# EasyEDA Pro project 2.4G8通道接收板1代.epro

# Schematic 2.4G8通道接收板
Create Date: 2023-10-29; Page Name: P1; Project Name: 遥控小车驱动小板; Schematic Name: 2.4G8通道遥控板; Update Date: 2023-11-30; Company: 嘉立创EDA; Page Size: A4; Version: V1.0
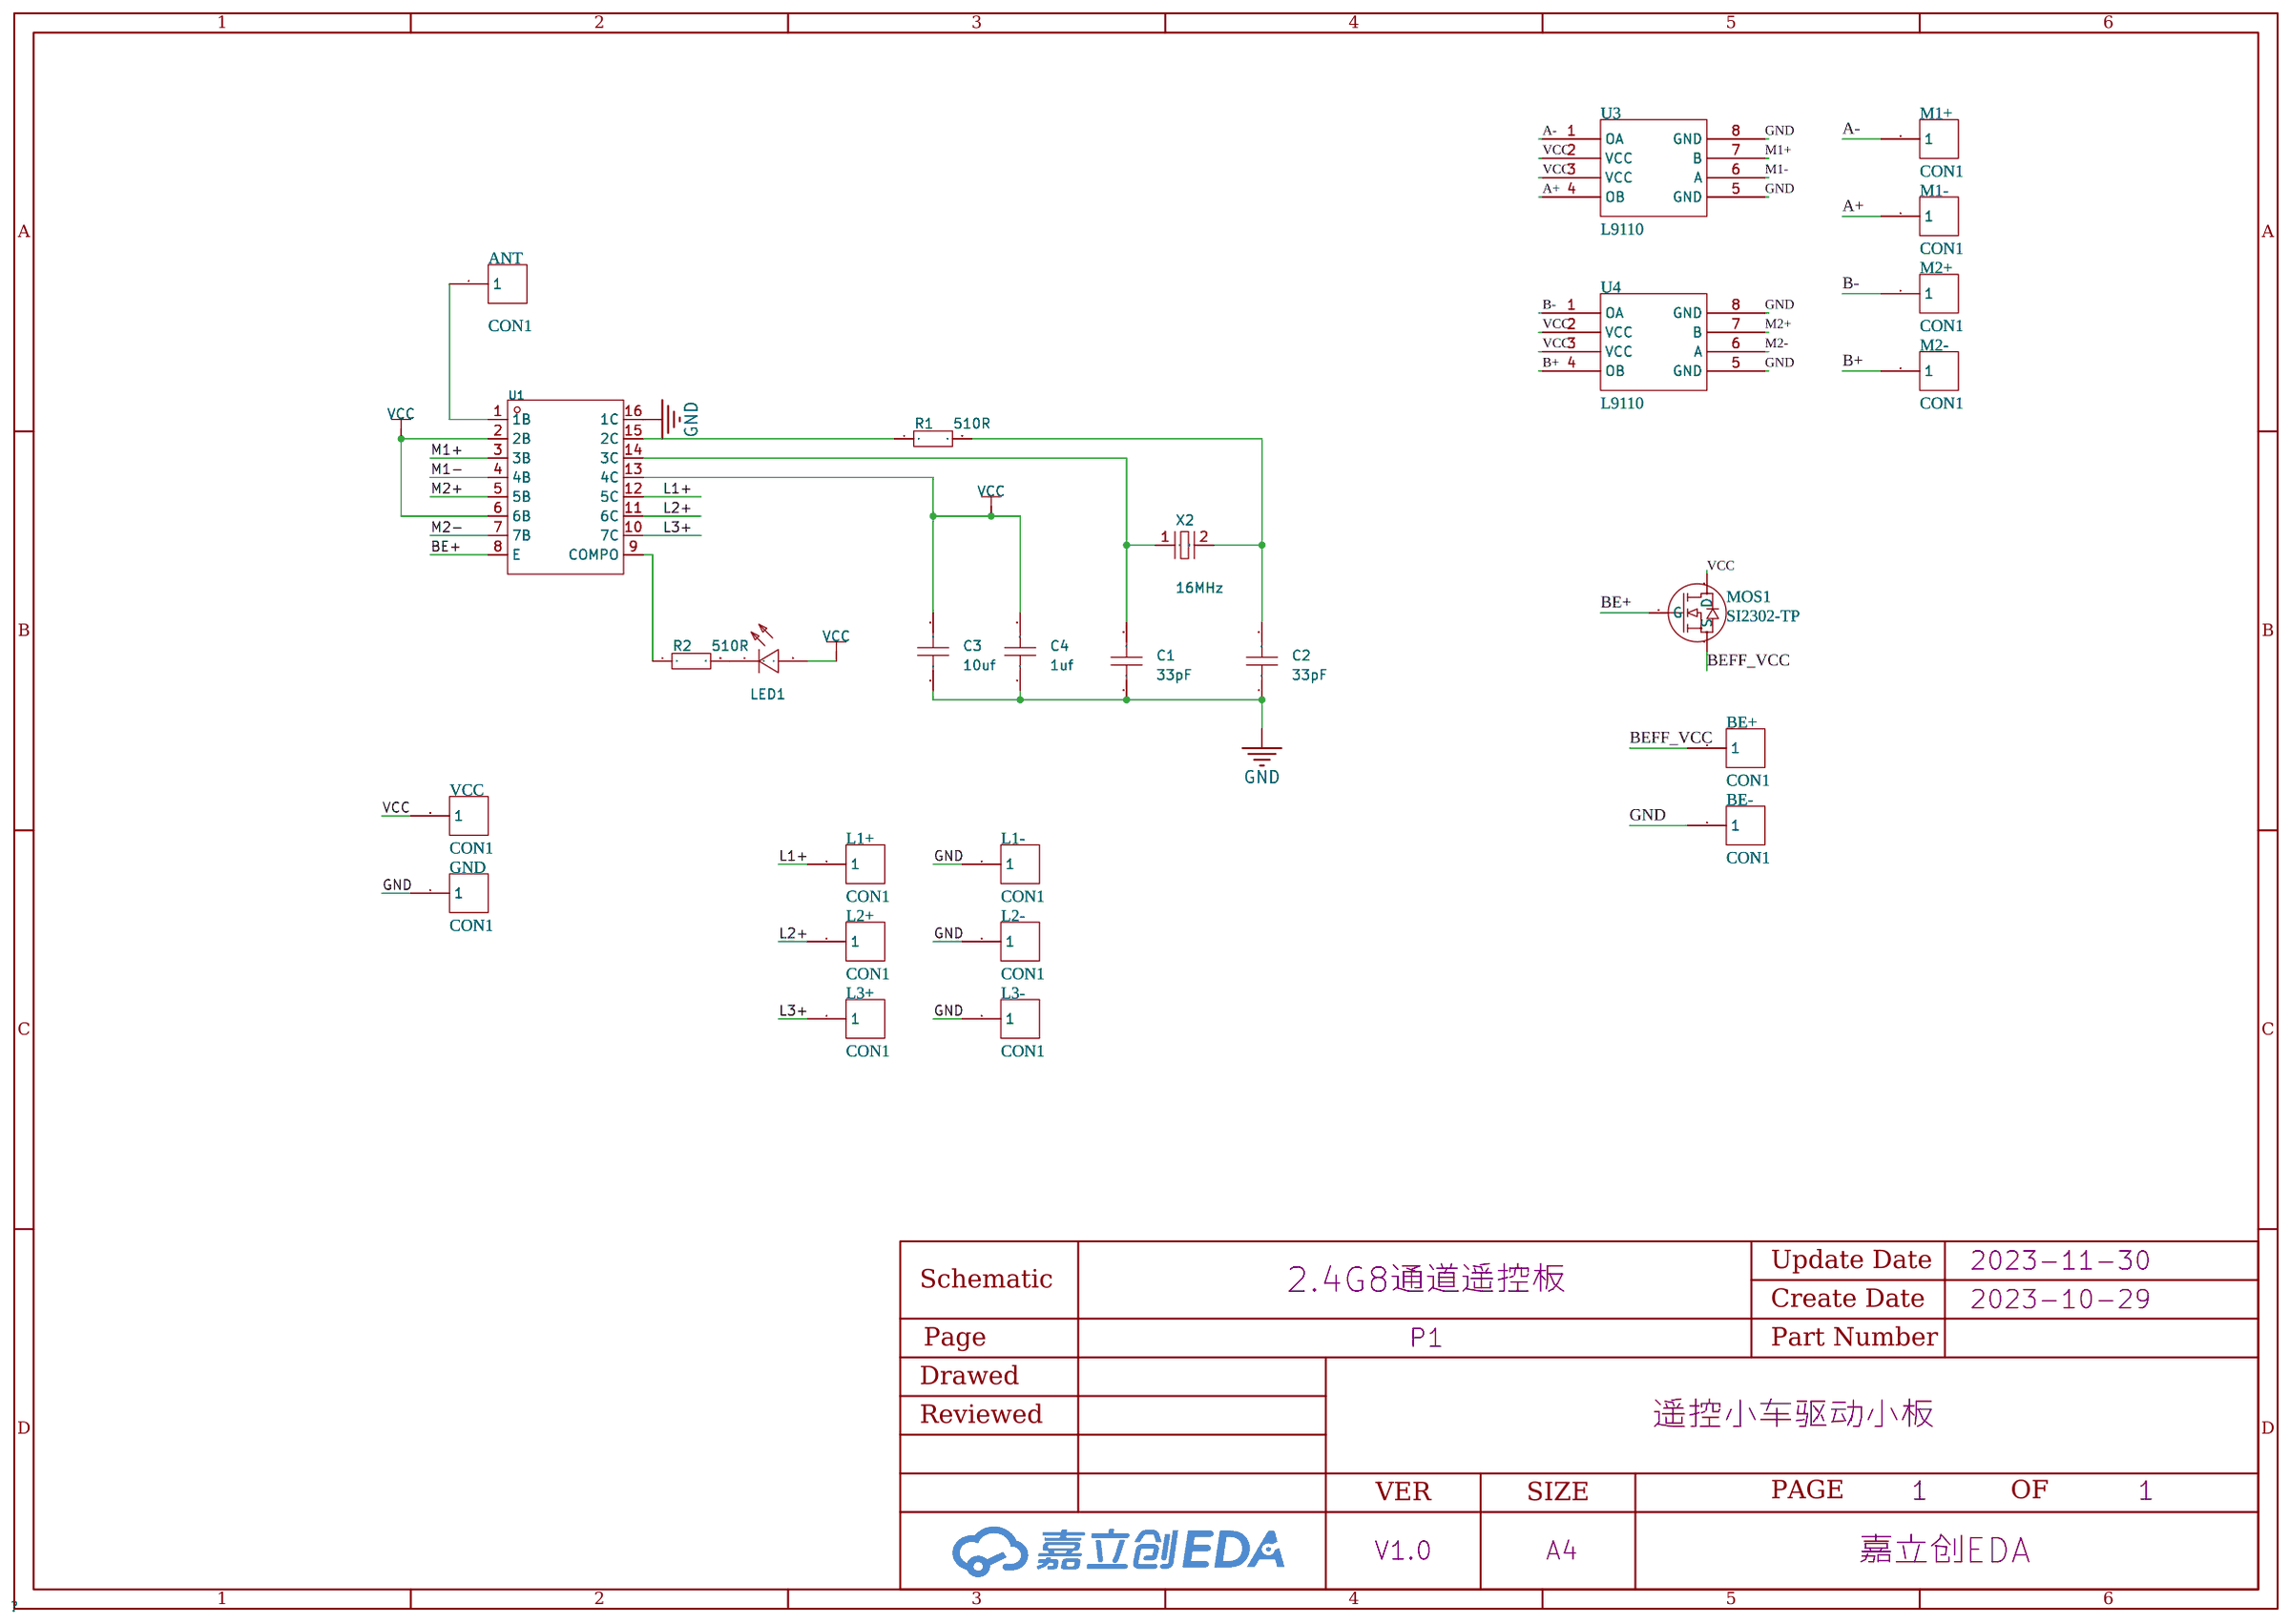
[diagram p0: schematic sheet]

## Parts
ANT  CON1  [CON1_2]
BE+  CON1  [CON1_2]
BE-  CON1  [CON1_2]
C1  33pF  [C0603]
C2  33pF  [C0603]
C3  10uf  [C0603]
C4  1uf  [C0603]
GND  CON1  [CON1_2]
L1+  CON1  [CON1_2]
L1-  CON1  [CON1_2]
L2+  CON1  [CON1_2]
L2-  CON1  [CON1_2]
L3+  CON1  [CON1_2]
L3-  CON1  [CON1_2]
LED1  NCD0603R1  [LED0603-RD_RED]
M1+  CON1  [CON1_2]
M1-  CON1  [CON1_2]
M2+  CON1  [CON1_2]
M2-  CON1  [CON1_2]
MOS1  SI2302-TP  [SOT-23_MCC]
R1  510R  [R0603]
R2  510R  [R0603]
U1  ULN2003A  [SOP-16_L10.0-W3.9-P1.27-LS6.0-BL]
U3  L9110  [SOP8]
U4  L9110  [SOP8]
VCC  CON1  [CON1_2]
X2  16MHz  [CRYSTAL-TH_BD3.0-P1.10-D0.4]

## Library data of the parts
ANT BE+ BE- GND L1+ L1- L2+ L2- L3+ L3- M1+ M1- M2+ M2- VCC = CON1: Library Name: 杰梗原理图库
C1-C4 = CAP_0603: Supplier Footprint: 0603
LED1 = NCD0603R1_C84263: 发光颜色:红色;功率:65mW;透镜颜色:无色透明;主波长:615nm~630nm;发光强度:80mcd~220mcd;发光角度:130°;工作温度:-30℃~+85℃;; LCSC Part Name: 红灯 0603红灯   正贴; Supplier Part: C84263; Manufacturer: 国星光电; Supplier Footprint: 0603; JLCPCB Part Class: 扩展库; Datasheet: https://atta.szlcsc.com/upload/public/pdf/source/20200820/C84263_DABC6A75E58F576973B407FDBA283D60.pdf; Supplier: LCSC; Emitted Color: 红色; Forward Voltage (VF): 1.6V~2.6V; Forward Current: 20mA; Power Dissipation: 65mW; Lens Color: 无色透明; Dominant Wavelength: 615nm~630nm; Luminous Intensity: 80mcd~220mcd; Viewing Angle: 130°; Operating Temperature: -30℃~+85℃
MOS1 = SI2302-TP: No Description Available; Copyright: Copyright (C) 2022 Ultra Librarian. All rights reserved.; Mfr_Name: MCC; Type: DEV
R1 R2 = Res_0603: Supplier Footprint: 0603
U1 = ULN2003A_C482013: 开态输入电压(VI(on)@Vce,Ic):3V@2V,300mA;集射极饱和压降(VCE(sat)@Ii,Ic):900mV;开态输入电流(Ii@Vi):930uA@3.85V;; Supplier Part: C482013; Manufacturer: UMW(友台半导体); Supplier Footprint: SOP-16; JLCPCB Part Class: 扩展库; Datasheet: https://atta.szlcsc.com/upload/public/pdf/source/20210729/C482013_EA98BD063A0F1E79EB7301A16A5D0011.pdf; Supplier: LCSC; ON-state input   voltage(VI(on)@Vce,Ic): 3V@2V,300mA; Collector-emitter   saturation voltage (VCE(sat)@Ii,Ic): 900mV; Output leakage current (Icex@Vce): 20uA@50V; Input current (Ii@Vi): 930uA@3.85V; Off-state input current (Ii(off)@Vce,Ic): 100uA@500uA; Clamp Diode Leakage Current (IR@VR): 5uA@50V; Clamp Diode Forward Voltage (VF@IF): 1.7V@350mA; Input Capacitance (Ci): 15pF; Operating Temperature: -40℃~+85℃
U3 U4 = L9110: Library Name: 杰梗原理图库
X2 = Q3816000ZWFAC: 频率:16MHz;频率公差:±20ppm;负载电容:20pF;; LCSC Part Name: 16MHz ±20ppm 20pF; Supplier Part: C2686281; Manufacturer: JYJE(晶友嘉); Supplier Footprint: DT-38; JLCPCB Part Class: Extended Part; Datasheet: https://atta.szlcsc.com/upload/public/pdf/source/20210125/C2686274_6F24C78119C1F58B7C4228EDB3C8DB66.pdf; Supplier: LCSC; Crystal Type: 直插无源晶振; Frequency Tolerance: ±20ppm; Frequency Stability: ±30ppm; Load Capacitance: 20pF; Equivalent Series Resistance (ESR): 60Ω; Operating Temperature: -40℃~+85℃

## Nets
GND: BE-.1 C1.1 C2.1 C3.1 C4.1 GND.1 L1-.1 L2-.1 L3-.1 U1.16(1C) U3.5(GND) U3.8(GND) U4.5(GND) U4.8(GND)
VCC: C3.2 C4.2 LED1.2(A) MOS1.3(D) U1.2(2B) U1.6(6B) U1.13(4C) U3.2(VCC) U3.3(VCC) U4.2(VCC) U4.3(VCC) VCC.1
A+: M1-.1 U3.4(OB)
A-: M1+.1 U3.1(OA)
B+: M2-.1 U4.4(OB)
B-: M2+.1 U4.1(OA)
BE+: MOS1.1(G) U1.8(E)
BEFF_VCC: BE+.1 MOS1.2(S)
L1+: L1+.1 U1.12(5C)
L2+: L2+.1 U1.11(6C)
L3+: L3+.1 U1.10(7C)
M1+: U1.3(3B) U3.7(B)
M1-: U1.4(4B) U3.6(A)
M2+: U1.5(5B) U4.7(B)
M2-: U1.7(7B) U4.6(A)
$1N1074: LED1.1(K) R2.2
Net-(ANT-1): ANT.1 U1.1(1B)
Net-(C1-2): C1.2 U1.14(3C) X2.1
Net-(C2-2): C2.2 R1.2 X2.2(GND)
Net-(R1-1): R1.1 U1.15(2C)
Net-(R2-1): R2.1 U1.9(COMPO)

# Board 2.4G8通道接收板
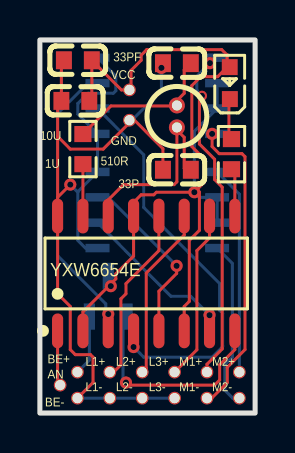
[diagram p1: board, top side]
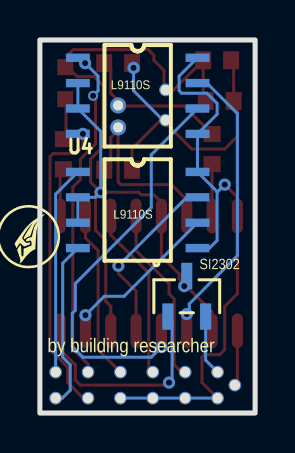
[diagram p2: board, bottom side, seen from below]

Outline 10.79 x 18.67 mm; copper layers: Top Layer, Bottom Layer. Coordinates in mm from the lower left corner of the outline.
Outline path: rectangle 0,18.67 10.79,0
Stack: Top Layer 0.035mm / Dielectric1 1.51mm FR4 er 4.5 / Bottom Layer 0.035mm

## Design rules (mm)
template: JLCPCB Capability(Two Layers Board)
spacing copperThickness1oz (default): track to track 0.102, other pairs 0.152 to 0.3
spacing copperThickness2oz: track to track 0.203, other pairs 0.152 to 0.3
track width copperThickness1oz (default): min 0.127, default 0.254, max 2.54
track width copperThickness2oz: min 0.203, default 0.254, max 2.54
differential pair differentialPair (default): width min 0.127, default 0.254, max 2.54; gap min 0.152, default 0.152
via viaSize (default): diameter min 0.5, default 0.61, max 10; hole min 0.3, default 0.305, max 6.3

## Placement (name value [footprint] x y rotation side)
1U  1uf  [C0603]  1.78 15.62 0 top
10U  10uf  [C0603]  1.91 17.65 0 top
33P  33pF  [C0603]  6.87 12.17 0 top
33PF  33pF  [C0603]  6.87 17.51 0 top
510R  510R  [R0603]  2.16 13.21 90 top
AN  CON1  [CON1_2]  1.02 1.4 0 top
BE+  CON1  [CON1_2]  1.88 2.05 0 top
BE-  CON1  [CON1_2]  1.88 0.75 0 top
GND  CON1  [CON1_2]  4.49 14.65 0 top
L1+  CON1  [CON1_2]  3.51 2.05 90 top
L1-  CON1  [CON1_2]  3.51 0.75 0 top
L2+  CON1  [CON1_2]  5.13 2.05 90 top
L2-  CON1  [CON1_2]  5.13 0.75 0 top
L3+  CON1  [CON1_2]  6.76 2.05 90 top
L3-  CON1  [CON1_2]  6.76 0.75 0 top
L9110S  -  [SOP8]  8.89 17.78 180 bottom
L9110S#2  -  [SOT-23_MCC]  3.43 5.84 180 bottom
LED1  NCD0603R1  [LED0603-RD_RED]  9.52 16.51 90 top
M1+  CON1  [CON1_2]  8.38 2.05 0 top
M1-  CON1  [CON1_2]  8.38 0.75 0 top
M2+  CON1  [CON1_2]  10 2.05 0 top
M2-  CON1  [CON1_2]  10 0.75 0 top
R2  510R  [R0603]  9.61 12.95 90 top
U4  L9110  [SOP8]  8.89 12.06 180 bottom
VCC  CON1  [CON1_2]  4.49 16.17 0 top
X2  16MHz  [CRYSTAL-TH_BD3.0-P1.10-D0.4]  6.87 14.84 90 top
YXW6654E  ULN2003A  [SOP-16_L10.0-W3.9-P1.27-LS6.0-BL]  5.33 6.98 0 top

## Footprints (pads in the part's own frame, mm; a bottom-side part is the same pattern mirrored in y, then rotated)
C0603
  rect 0.8x0.9 smd: 1(-0.7,0) 2(0.7,0)
CON1_2
  round 0.635 hole 0.508: 1(0,0)
CRYSTAL-TH_BD3.0-P1.10-D0.4
  round 0.8 hole 0.5: 1(-0.55,0) 2(0.55,0)
LED0603-RD_RED
  rect 0.8x0.8 smd: 1(-0.799,-0.004) 2(0.799,0.004)
R0603
  rect 0.806x0.864 smd: 1(-0.753,0) 2(0.753,0)
SOP8
  rect 1.2x0.42 smd: 1(0,0) 2(0,-1.27) 3(0,-2.54) 4(0,-3.81) 5(6,-3.81) 6(6,-2.54) 7(6,-1.27) 8(6,0)
SOP-16_L10.0-W3.9-P1.27-LS6.0-BL
  oval 0.56x1.745 smd: 1(-4.445,-2.873) 2(-3.175,-2.873) 3(-1.905,-2.873) 4(-0.635,-2.873) 5(0.635,-2.873) 6(1.905,-2.873) 7(3.175,-2.873) 8(4.445,-2.873) 9(4.445,2.873) 10(3.175,2.873) 11(1.905,2.873) 12(0.635,2.873) 13(-0.635,2.873) 14(-1.905,2.873) 15(-3.175,2.873) 16(-4.445,2.873)
SOT-23_MCC
  rect 0.559x1.321 smd: 1(-0.946,-1.016) 2(0.946,-1.016) 3(0,1.016)

## Nets
GND: 1U.1 10U.1 33P.1 33PF.1 BE-.1 GND.1 L1-.1 L2-.1 L3-.1 L9110S.5 L9110S.8 U4.5 U4.8 YXW6654E.16
VCC: 1U.2 10U.2 L9110S.2 L9110S.3 L9110S#2.3 LED1.2 U4.2 U4.3 VCC.1 YXW6654E.2 YXW6654E.6 YXW6654E.13
A+: L9110S.4 M1-.1
A-: L9110S.1 M1+.1
B+: M2-.1 U4.4
B-: M2+.1 U4.1
BE+: L9110S#2.1 YXW6654E.8
BEFF_VCC: BE+.1 L9110S#2.2
L1+: L1+.1 YXW6654E.12
L2+: L2+.1 YXW6654E.11
L3+: L3+.1 YXW6654E.10
M1+: L9110S.7 YXW6654E.3
M1-: L9110S.6 YXW6654E.4
M2+: U4.7 YXW6654E.5
M2-: U4.6 YXW6654E.7
$1N661: 33PF.2 510R.2 X2.2
$1N667: 510R.1 YXW6654E.15
$1N672: 33P.2 X2.1 YXW6654E.14
$1N923: AN.1 YXW6654E.1
$1N1074: LED1.1 R2.2
$1N1154: R2.1 YXW6654E.9

## Via types
v1: diameter 0.61, hole 0.305, Top Layer to Bottom Layer, 11 vias
v2: diameter 0.508, hole 0.305, Top Layer to Bottom Layer, 1 via

## Routing (per net, layer and track width the routed paths; a pad name or vN(x,y) marks a point on that pad's centre or on a via; arc(x,y) is an arc through that point)
GND: length 49.1
  Top Layer w0.152: 0.89,10.8 0.89,13.84 ; 0.89,10.8 v1(1.52,11.43) ; 0.89,10.8 YXW6654E.16 0.89,5.97 1.52,5.33 1.52,3.17 1.78,2.92 2.54,2.92 2.67,2.79 2.67,1.53 BE-.1 ; 0.89,13.84 0.89,15.43 1U.1 1.08,17.53 10U.1 ; 0.89,13.84 0.89,13.84 1.52,13.21 3.17,13.21 4.68,14.72 6.17,13.23 6.17,12.05
  Bottom Layer w0.152: v1(6.1,17.27) 6.1,16.13 4.68,14.72 4.75,14.65 ; 1.91,11.05 1.91,11.08 U4.8 L9110S.5 1.91,14.95 1.91,15.49 2.41,16 3.68,16 3.81,16.13 3.81,16.86 L9110S.8 ; 1.91,11.05 v1(1.52,11.43) ; 1.91,11.05 1.91,8.64 2.29,8.25 U4.5 ; BE-.1 L1-.1 L2-.1 L3-.1
VCC: length 46.5
  Top Layer w0.152: v1(7.75,11.05) 8.25,11.56 8.25,12.7 7.62,13.33 7.62,16.38 8.07,16.83 8.92,16.83 9.39,17.31 ; v1(7.75,11.05) 8,11.05 8,9.14 7.49,8.64 7.49,5.59 7.24,5.33 YXW6654E.6 ; v1(7.75,11.05) 5.84,11.05 5.72,10.92 5.08,10.92 4.7,10.54 4.7,7.85 3.81,6.96 3.81,6.71 2.16,5.06 YXW6654E.2 ; 1U.2 2.6,15.75 10U.2 4.09,16.17 4.57,16.17 4.57,17.14 5.08,17.65 5.08,17.91 5.36,18.19 9.12,18.19 9.39,17.91 9.39,17.31 ; 9.39,17.31 LED1.2
  Bottom Layer w0.152: U4.3 U4.2 8,10.8 v1(7.75,11.05) 7.75,14.1 L9110S.3 8.89,16.51
  vias: v1(3.56,6.35)
A+: length 15.5
  Top Layer w0.152: M1-.1 8.62,0.75 9.4,1.52 9.4,2.29 10.29,3.17 10.29,12.83 10.13,12.98 8.99,12.98 8.64,13.33 v1(8.64,13.97)
A-: length 16.7
  Top Layer w0.152: v2(8.13,15.88) 8,15.75 8,13.46 8.76,12.7 8.76,11.68 9.14,11.3 9.14,3.21 8.38,2.44 M1+.1
  Bottom Layer w0.152: v1(8.53,17.51) 7.87,16.86 7.87,16.13 v2(8.13,15.88)
B+: length 8.5
  Bottom Layer w0.152: M2-.1 9.67,0.75 9.27,1.14 9.27,2.41 9.65,2.79 9.65,7.49 U4.4
B-: length 10.5
  Bottom Layer w0.152: M2+.1 10,10.95 U4.1
BE+: length 11.1
  Top Layer w0.152: YXW6654E.8 9.78,3.17 9.02,2.41 9.02,1.65 8.76,1.4 4.44,1.4 v1(4.32,1.52)
  Bottom Layer w0.152: v1(4.32,1.52) 4.17,1.68 4.17,4.62 L9110S#2.1
BEFF_VCC: length 3
  Bottom Layer w0.152: L9110S#2.2 2.48,2.65 BE+.1
L1+: length 8.9
  Top Layer w0.152: L1+.1 3.7,2.05 4.06,2.41 4.06,5.71 4.32,5.97 4.32,6.48 5.97,8.13 YXW6654E.12
L2+: length 8.7
  Top Layer w0.152: L2+.1 5.33,2.25 5.33,7 7.24,8.91 YXW6654E.11
L3+: length 8.5
  Top Layer w0.152: L3+.1 7.87,3.17 7.87,8.13 8.51,8.76 YXW6654E.10
M1+: length 13.7
  Bottom Layer w0.152: v1(3.43,4.95) 3.3,5.08 3.3,5.46 0.89,7.87 0.89,14.99 2.41,16.51 2.89,16.51
M1-: length 19.4
  Bottom Layer w0.152: L9110S.6 5.21,12.92 5.21,10.29 9.02,6.48 9.02,5.14 9.17,4.99 9.17,3.33 8.64,2.79 5.21,2.79 v1(4.7,3.3)
M2+: length 9
  Top Layer w0.152: v1(6.86,7.37) 6.86,6.98 5.97,6.1 YXW6654E.5
  Bottom Layer w0.152: U4.7 3.43,10.8 v1(6.86,7.37)
M2-: length 7.7
  Bottom Layer w0.152: U4.6 6.57,5.84 7.56,5.84 v1(8.51,4.9) 8.51,4.7
$1N661: length 7.7
  Top Layer w0.152: 510R.2 3.56,15.37 6.77,15.37 6.87,15.26 ; 33PF.2 7.24,17.17 7.24,16 6.87,15.63 X2.2
$1N667: length 2.6
  Top Layer w0.152: 510R.1 YXW6654E.15
$1N672: length 9.6
  Top Layer w0.152: YXW6654E.14 3.43,10.67 4.19,11.43 6.73,11.43 6.87,11.57 6.87,14.16 7.24,13.8 7.24,12.25 7.44,12.05
$1N923: length 2.8
  Top Layer w0.152: YXW6654E.1 0.89,1.52 AN.1
$1N1074: length 2
  Top Layer w0.152: 9.4,15.71 9.48,15.63 9.48,13.71
$1N1154: length 2.5
  Top Layer w0.152: YXW6654E.9 9.78,11.9 9.48,12.2

## Text on the board
Bottom Silkscreen Layer: SI2302 | by building researcher
